# Altium schematic sheet ADC.SchDoc
size Tabloid
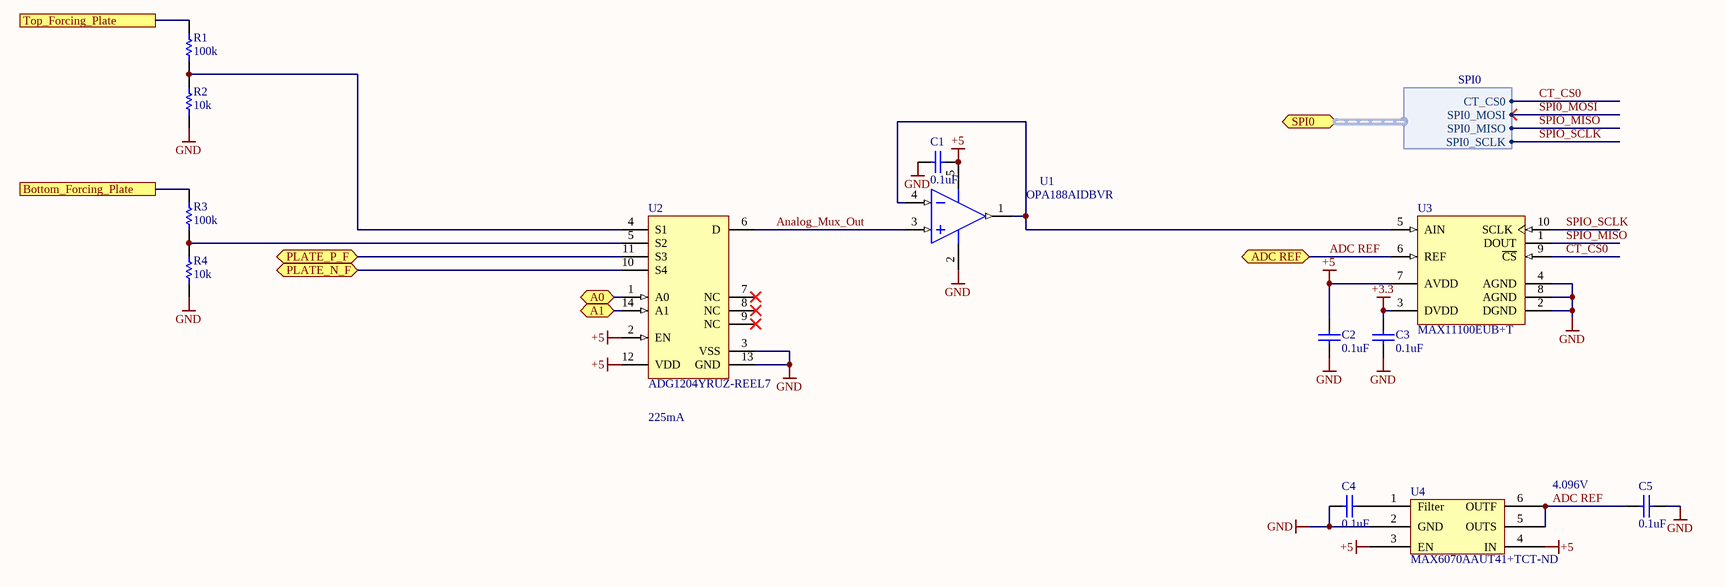
[diagram p0: ADC.SchDoc]

## Parts
C1  0.1uF  [CAPC0402(1005)60_L]
C2  0.1uF  [CAPC0402(1005)60_L]
C3  0.1uF  [CAPC0402(1005)60_L]
C4  0.1uF  [CAPC0402(1005)60_L]
C5  0.1uF  [CAPC0402(1005)60_L]
R1  100k  [RESC0402(1005)_M]
R2  10k  [RESC0402(1005)_M]
R3  100k  [RESC0402(1005)_M]
R4  10k  [RESC0402(1005)_M]
U1  OPA188AIDBVR  [DBV0005A_M]
U2  ADG1204YRUZ-REEL7  [ADI-RU-14_L]
U3  MAX11100EUB+T  [U10+2_L]
U4  Supplier Part Number 1: MAX6070AAUT41+TCT-ND  [SOT95P280X445-6N]  (hidden comment: MAX6070AAUT41+T)

## Ports
A0, A1, ADC REF, Bottom_Forcing_Plate, PLATE_N_F, PLATE_P_F, SPI0 (harness SPI0), Top_Forcing_Plate

## Harnesses
SPI0: CT_CS0, SPI0_MOSI, SPI0_MISO, SPI0_SCLK

## Nets
+3.3: C3.2 U3.3(DVDD)
+5: C1.2 C2.2 U1.5(V+) U2.2(EN) U2.12(VDD) U3.7(AVDD) U4.3(EN) U4.4(IN)
GND: C1.1 C2.1 C3.1 C4.1 C5.2 R2.2 R4.2 U1.2(V-) U2.3(VSS) U2.13(GND) U3.2(DGND) U3.4(AGND) U3.8(AGND) U4.2(GND)
A0: U2.1(A0) ; port A0
A1: U2.14(A1) ; port A1
ADC REF: C5.1 U3.6(REF) U4.5(OUTS) U4.6(OUTF) ; port ADC REF
Analog_Mux_Out: U1.3(IN+) U2.6(D)
Bottom_Forcing_Plate: R3.1 ; port Bottom_Forcing_Plate
CT_CS0: U3.9(~{CS}) ; port SPI0.CT_CS0
PLATE_N_F: U2.10(S4) ; port PLATE_N_F
PLATE_P_F: U2.11(S3) ; port PLATE_P_F
SPI0_MOSI: port SPI0.SPI0_MOSI
SPIO_MISO: U3.1(DOUT) ; port SPI0.SPI0_MISO
SPIO_SCLK: U3.10(SCLK) ; port SPI0.SPI0_SCLK
Top_Forcing_Plate: R1.1 ; port Top_Forcing_Plate
NetC4_2: C4.2 U4.1(Filter)
NetR1_2: R1.2 R2.1 U2.4(S1)
NetR3_2: R3.2 R4.1 U2.5(S2)
NetU1_1: U1.1(OUT) U1.4(IN-) U3.5(AIN)

Not connected (* = marked no-connect by the designer): U2 7(NC)* 8(NC)* 9(NC)*

## Notes on the sheet
- (near U2) 225mA
- 4.096V
- Title
- Size:
- Date:
- Tabloid
- Number:
- Time:
- Revision:
- Sheet
- of
- ZLS Corporation
- 7801 North Lamar Blvd.
- Suite E-184
- Austin, Texas 78752  USA
- (512) 453-0288
- File:

## Library data of the parts
C1-C5 = CMP-1034-00252-1: CAP CER 0.1UF 10V X7R 0402; Manufacturer: Murata Electronics North America; Manufacturer Part Number: GRM155R71A104KA01D; Tolerance: ±10%; Supplier 1: Digi-Key; Supplier Part Number 1: 490-6321-1-ND; RoHS: RoHS Compliant; Category: Capacitors; Stock 1: 2920395; Pricing 1: 1=0.1, 10=0.014, 100=0.0063, 500=0.00446, 1000=0.00351, 2500=0.00319, 5000=0.00293 (USD); Packaging: Cut Tape (CT); Part Status: Active; Voltage - Rated: 10V; Temperature Coefficient: X7R; Operating Temperature: -55°C ~ 125°C; Features: -; Ratings: -; Applications: General Purpose; Mounting Type: Surface Mount, MLCC; Package / Case: 0402 (1005 Metric); Size / Dimension: 0.039" L x 0.020" W (1.00mm x 0.50mm); Height - Seated (Max): -; Thickness (Max): 0.022" (0.55mm); Lead Spacing: -; ComponentLink1URL: http://www.murata.com/~/media/webrenewal/support/library/catalog/products/capacitor/mlcc/c02e.ashx?la=en-us; ComponentLink1Description: http://www.murata.com/~/media/webrenewal/support/library/catalog/products/capacitor/mlcc/c02e.ashx?la=en-us
R1-R4 = CMP-1011-00463-1
U1 = CMP-0809-00005-2: Precision, Low Noise, Rail-to-Rail Output, Zero-Drift Operational Amplifier, 4 to 36 V, -40 to 125 degC, 5-pin SOT23 (DBV5), Green (RoHS & no Sb/Br); Manufacturer: Texas Instruments; Unity Gain Bandwidth Product: 2MHz; Max Supply Voltage: 36V; Min Supply Voltage: 4V; Min Dual Supply Voltage: 2V; Max Dual Supply Voltage: 18V; Nominal Supply Current: 510uA; Common Mode Rejection Ratio: 120dB; Number of Channels: 1; Slew Rate: 0.8V/µs; Input Bias Current: 160pA; Input Offset Voltage (Vos): 6uV; Operating Supply Current: 450uA; Output Current per Channel: 18mA; Voltage Gain: 136dB; Input Voltage Noise Density: 8.8nV/sqrt Hz; Power Supply Rejection Ratio (PSRR): 142dB; Supplier 1: Arrow; Supplier Part Number 1: OPA188AIDBVR; Manufacturer Part Number: OPA188AIDBVR; Stock 1: 95; Pricing 1: 1=2.1871, 10=1.943, 25=1.9086, 100=1.5565, 250=1.5371, 500=1.3168, 1000=1.2243 (USD); Case/Package: SOT-23-5; Number of Pins: 5; Contact Plating: Nickel,Gold; Min Operating Temperature: -40°C; Max Operating Temperature: 125°C; Packaging: Tape and Reel; Package Quantity: 3000; Nominal Gain Bandwidth Product: 2MHz; Number of Circuits: 1; Gain Bandwidth Product: 2MHz; Number of Elements: 1; Lead Free: Lead Free; ComponentLink1URL: https://datasheet.ciiva.com/24017/opa188-372986-24017253.pdf; ComponentLink1Description: https://datasheet.ciiva.com/24017/opa188-372986-24017253.pdf; ComponentLink2URL: https://datasheet.ciiva.com/18622/opa188-18622375.pdf; ComponentLink2Description: https://datasheet.ciiva.com/18622/opa188-18622375.pdf
U2 = CMP-0793-00109-1: Low Capacitance, Low Charge Injection, +/-15 V / +12 V, 4:1 iCMOS Multiplexer, 120 Ohm Ron, 14-pin SOP (RU-14), Reel; Manufacturer: Maxim Integrated; Manufacturer Part Number: MAX11100EUB+; Number of Bits: 16; Sampling Rate (Per Second): 200k; Number of Inputs: 1; Input Type: Single Ended; Data Interface: SPI; Configuration: S/H-ADC; Ratio - S/H:ADC: 1:1; Architecture: SAR; Reference Type: External; Voltage - Supply, Analog: 5V; Voltage - Supply, Digital: 2.7 V ~ 5.25 V; Supplier 1: Digi-Key; Supplier Part Number 1: MAX11100EUB+-ND; RoHS: RoHS Compliant; Category: Integrated Circuits (ICs); Stock 1: 927; Pricing 1: 1=5.98, 10=5.855 (USD); Packaging: Tube; Part Status: Active; Features: -; Operating Temperature: -40°C ~ 85°C; Package / Case: 10-TFSOP, 10-MSOP (0.118", 3.00mm Width); Supplier Device Package: 10-uMAX; Base Part Number: MAX11100; ComponentLink1URL: https://datasheets.maximintegrated.com/en/ds/MAX11100.pdf; ComponentLink1Description: https://datasheets.maximintegrated.com/en/ds/MAX11100.pdf
U3 = CMP-0249-00017-1: 16-Bit, +5V, 200ksps ADC with 10uA Shutdown, 10-Pin uMAX, -40°C to +85°C, Pb-Free, Tape and Reel; Manufacturer: Maxim Integrated; Number of Bits: 16; Sampling Rate (Per Second): 200k; Number of Inputs: 1; Input Type: Single Ended; Data Interface: SPI; Configuration: S/H-ADC; Ratio - S/H:ADC: 1:1; Architecture: SAR; Reference Type: External; Voltage - Supply, Analog: 5V; Voltage - Supply, Digital: 2.7 V ~ 5.25 V; Supplier 1: Digi-Key; Supplier Part Number 1: MAX11100EUB+-ND; Manufacturer Part Number: MAX11100EUB+; RoHS: RoHS Compliant; Category: Integrated Circuits (ICs); Stock 1: 927; Pricing 1: 1=5.98, 10=5.855 (USD); Packaging: Tube; Part Status: Active; Features: -; Operating Temperature: -40°C ~ 85°C; Package / Case: 10-TFSOP, 10-MSOP (0.118", 3.00mm Width); Supplier Device Package: 10-uMAX; Base Part Number: MAX11100; ComponentLink1URL: https://datasheets.maximintegrated.com/en/ds/MAX11100.pdf; ComponentLink1Description: https://datasheets.maximintegrated.com/en/ds/MAX11100.pdf
U4 = MAX6070AAUT41+T: IC VREF SERIES 4.096V SOT23; Manufacturer: Maxim Integrated; Output Type: Fixed; Tolerance: ±0.04%; Temperature Coefficient: 6ppm/°C; Noise - 0.1Hz to 10Hz: 9.6µVp-p; Noise - 10Hz to 10kHz: 9µVrms; Voltage - Input: 4.3 V ~ 5.5 V; Current - Supply: 350µA; Supplier 1: Digi-Key; Manufacturer Part Number: MAX6070AAUT41+T; RoHS: RoHS Compliant; Category: Integrated Circuits (ICs); Stock 1: 2623; Pricing 1: 1=3.41, 10=3.213, 25=2.5704, 50=2.4418, 100=2.2491, 250=2.13344, 500=2.05634 (USD); Packaging: Cut Tape (CT); Part Status: Active; Reference Type: Series; Voltage - Output (Min/Fixed): 4.096V; Operating Temperature: -40°C ~ 125°C (TA); Mounting Type: Surface Mount; Package / Case: SOT-23-6; Supplier Device Package: SOT-23-6; ComponentLink1URL: https://datasheets.maximintegrated.com/en/ds/MAX6070-MAX6071.pdf; ComponentLink1Description: https://datasheets.maximintegrated.com/en/ds/MAX6070-MAX6071.pdf